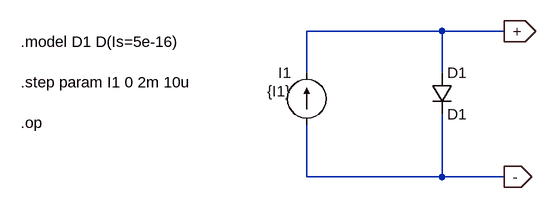
[diagram p0: schematic schematic.asc]
schematic.asc, the LTspice schematic file:
Version 4.1
SHEET 1 880 680
WIRE 272 64 64 64
WIRE 368 64 272 64
WIRE 64 128 64 64
WIRE 272 128 272 64
WIRE 64 288 64 208
WIRE 272 288 272 192
WIRE 272 288 64 288
WIRE 368 288 272 288
FLAG 368 64 +
IOPIN 368 64 Out
FLAG 368 288 -
IOPIN 368 288 Out
SYMBOL current 64 208 R180
WINDOW 0 24 80 Left 2
WINDOW 3 24 52 Left 2
WINDOW 123 0 0 Left 0
WINDOW 39 0 0 Left 0
SYMATTR InstName I1
SYMATTR Value {I1}
SYMBOL diode 256 128 R0
SYMATTR InstName D1
SYMATTR Value D1
TEXT -376 80 Left 2 !.model D1 D(Is=5e-16)\n \n.step param I1 0 2m 10u\n \n.op

The netlist it stands for:
* schematic.asc
I1 - + {I1}
D1 + - D1
.model D D
.lib standard.dio
.model D1 D(Is=5e-16)
.step param I1 0 2m 10u
.op
.backanno
.end